# EAGLE design MCU_Module V3 (EAGLE 7.6.0)
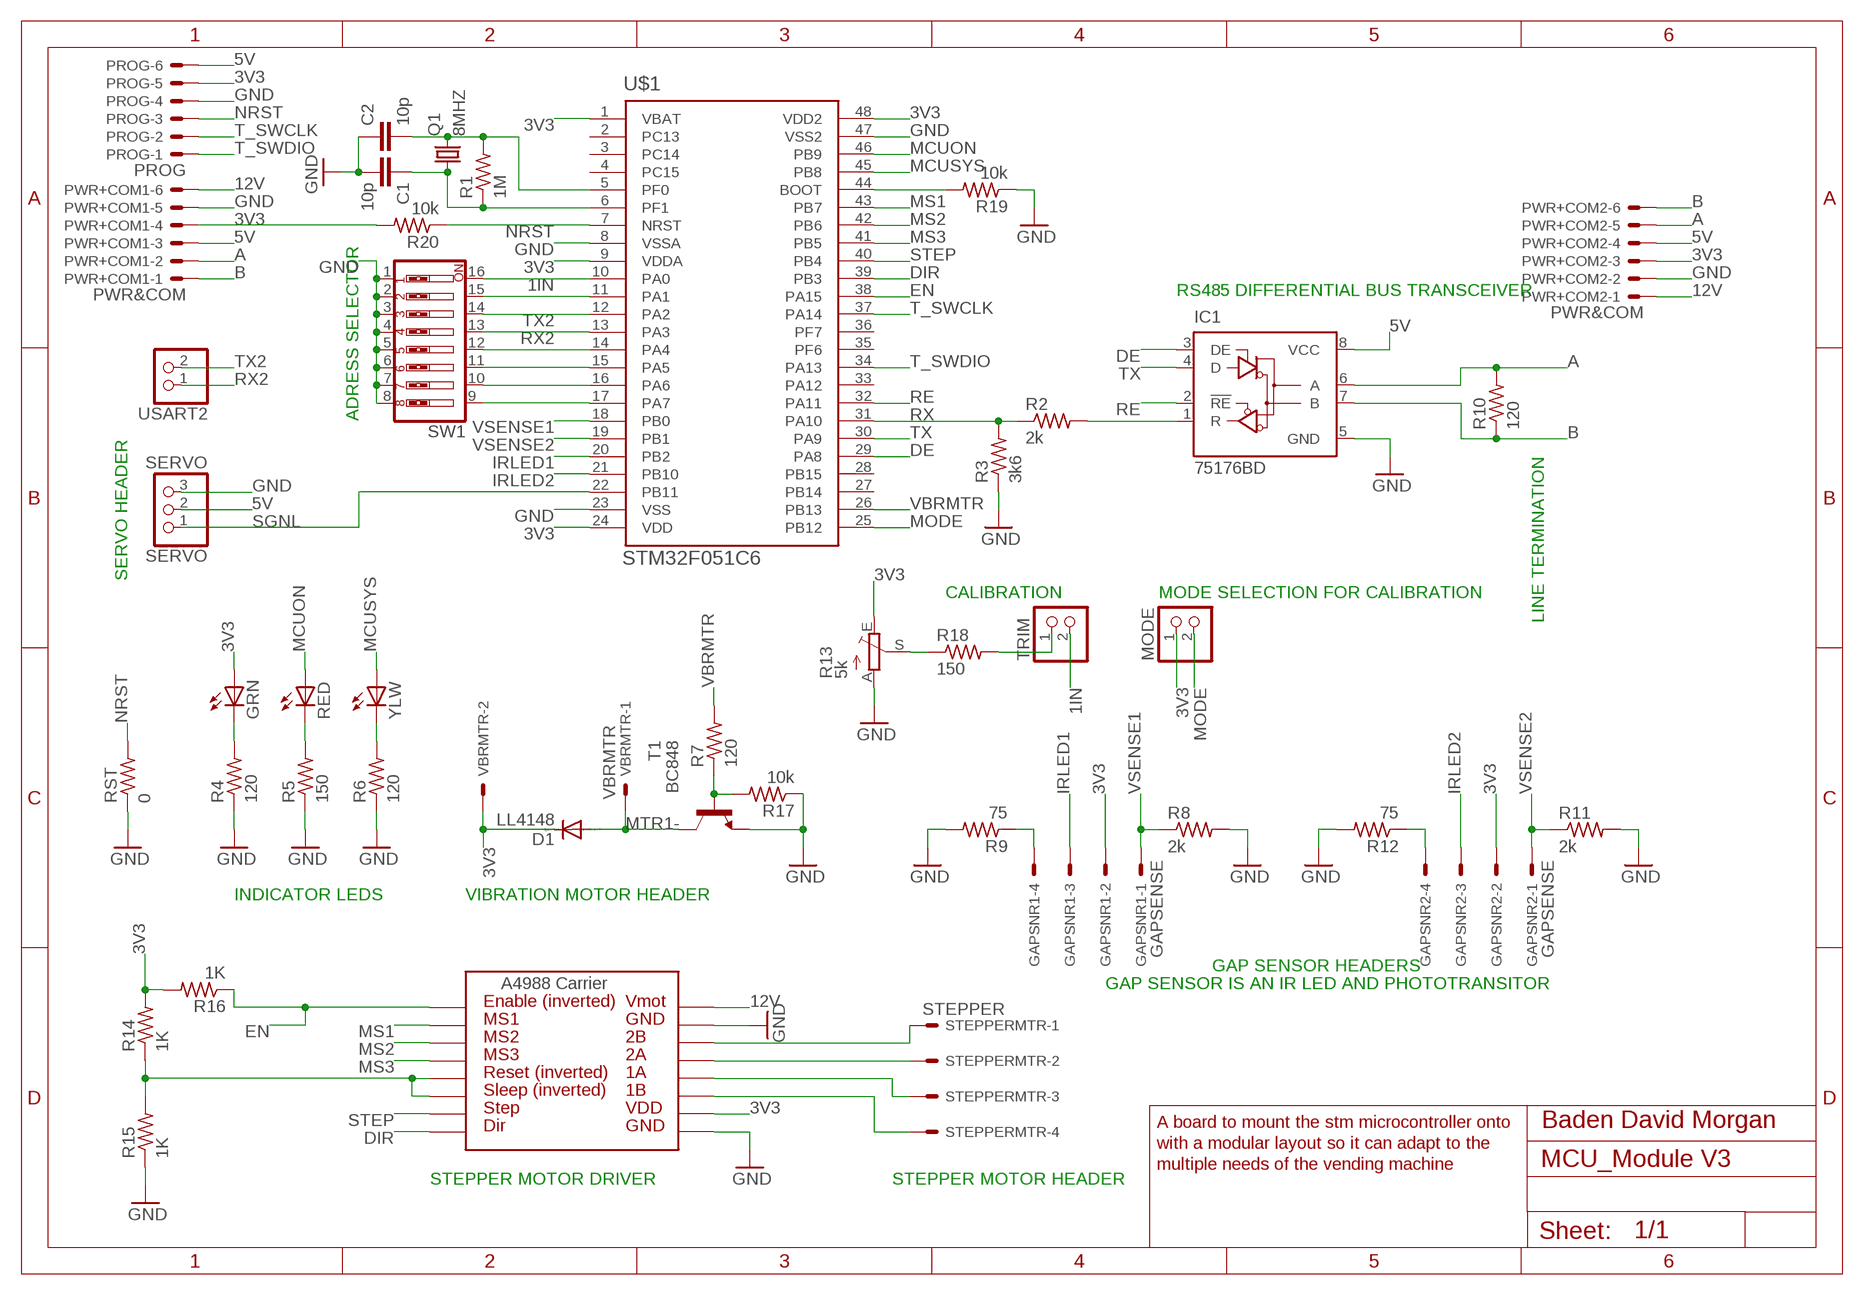
[diagram p0: schematic, sheet 1]

## Parts
C1  10p  C-EUC0805  [C0805]
C2  10p  C-EUC0805  [C0805]
D1  LL4148  PMLL4150  [SOD80C]
GAPSNR1  GAPSENSE  22-27-2041-04  [6410-04]
GAPSNR2  GAPSENSE  22-27-2041-04  [6410-04]
GRN  LEDSML1206  [SML1206]
IC1  75176BD  75176AD  [D_R-PDSO-G8]
MODE  PINHD-1X2  [1X02]
PROG  PROG  22-27-2061-06  [6410-06]
PWR+COM1  PWR&COM  22-05-7068-06  [7395-06]
PWR+COM2  PWR&COM  22-05-7068-06  [7395-06]
Q1  8MHZ  CRYSTALSM49  [SM49]
R1  1M  R-US_R0805  [R0805]
R2  2k  R-US_R0805  [R0805]
R3  3k6  R-US_R0805  [R0805]
R4  120  R-US_R0805  [R0805]
R5  150  R-US_R0805  [R0805]
R6  120  R-US_R0805  [R0805]
R7  120  R-US_R0805  [R0805]
R8  2k  R-US_R0805  [R0805]
R9  75  R-US_R0805  [R0805]
R10  120  R-US_R0805  [R0805]
R11  2k  R-US_R0805  [R0805]
R12  75  R-US_R0805  [R0805]
R13  5k  TRIM_EU-B25P  [B25P]
R14  1K  R-US_R0805  [R0805]
R15  1K  R-US_R0805  [R0805]
R16  1K  R-US_R0805  [R0805]
R17  10k  R-US_R0805  [R0805]
R18  150  R-US_R0805  [R0805]
R19  10k  R-US_R0805  [R0805]
R20  10k  R-US_R0805  [R0805]
RED  LEDSML1206  [SML1206]
RST  0  R-US_R0805  [R0805]
SERVO  SERVO  PINHD-1X3  [1X03]
STEPPERMTR  STEPPER  22-27-2041-04  [6410-04]
SW1  SW_DIP-8  [EDG-08]
T1  BC848  [SOT23]
TRIM  PINHD-1X2  [1X02]
U$1  STM32F051C6  [QFP50P900X900X160-48N]
U$2  A4983CARRIER  [A4988BREAKOUT]
USART2  PINHD-1X2  [1X02]
VBRMTR  VBRMTR  22-27-2021-02  [6410-02]
YLW  LEDSML1206  [SML1206]

## Nets
1IN: SW1.16 TRIM.2 U$1.10(PA0)
3V3: D1.C GAPSNR1.2 GAPSNR2.2 GRN.A MODE.1 PROG.5 PWR+COM1.4 PWR+COM2.3 R13.E R14.2 R16.2 R20.2 U$1.1(VBAT) U$1.9(VDDA) U$1.24(VDD) U$1.48(VDD2) U$2.VDD VBRMTR.2
5V: IC1.8(VCC) PROG.6 PWR+COM1.3 PWR+COM2.4 SERVO.2
8IN: SW1.9 U$1.17(PA7)
12V: PWR+COM1.6 PWR+COM2.1 U$2.VMOT
A: IC1.6(A) PWR+COM1.2 PWR+COM2.5 R10.2
B: IC1.7(B) PWR+COM1.1 PWR+COM2.6 R10.1
DE: IC1.3(DE) U$1.29(PA8)
DIR: U$1.39(PB3) U$2.DIR
EN: R16.1 U$1.38(PA15) U$2.EN
GND: C1.2 C2.1 IC1.5(GND) PROG.4 PWR+COM1.5 PWR+COM2.2 R3.1 R4.1 R5.1 R6.1 R8.2 R9.2 R11.2 R12.2 R13.A R15.1 R17.1 R19.1 RST.1 SERVO.3 SW1.1 SW1.2 SW1.3 SW1.4 SW1.5 SW1.6 SW1.7 SW1.8 T1.2(E) U$1.8(VSSA) U$1.23(VSS) U$1.47(VSS2) U$2.GND U$2.GND@0(GND)
IRLED1: GAPSNR1.3 U$1.20(PB2)
IRLED2: GAPSNR2.3 U$1.21(PB10)
MCUON: RED.A U$1.46(PB9)
MCUSYS: U$1.45(PB8) YLW.A
MODE: MODE.2 U$1.25(PB12)
MS1: U$1.43(PB7) U$2.MS1
MS2: U$1.42(PB6) U$2.MS2
MS3: U$1.41(PB5) U$2.MS3
MTR1-: D1.A T1.3(C) VBRMTR.1
N$1: C1.1 Q1.1 R1.1 U$1.6(PF1)
N$2: C2.2 Q1.2 R1.2 U$1.5(PF0)
N$5: STEPPERMTR.4 U$2.1B
N$6: SW1.15 U$1.11(PA1)
N$9: IC1.1(R) R2.2
N$10: SW1.12 U$1.14(PA4)
N$11: SW1.11 U$1.15(PA5)
N$12: SW1.10 U$1.16(PA6)
N$13: R13.S R18.1
N$14: GRN.C R4.2
N$15: R5.2 RED.C
N$16: R6.2 YLW.C
N$17: R7.1 R17.2 T1.1(B)
N$18: STEPPERMTR.3 U$2.1A
N$19: GAPSNR1.4 R9.1
N$20: STEPPERMTR.2 U$2.2A
N$21: STEPPERMTR.1 U$2.2B
N$22: R19.2 U$1.44(BOOT)
N$23: R18.2 TRIM.1
N$24: GAPSNR2.4 R12.1
N$26: R14.1 R15.2 U$2.RST U$2.SLP(SLEEP)
NRST: PROG.3 R20.1 RST.2 U$1.7(NRST)
RE: IC1.2(!RE) U$1.32(PA11)
RX: R2.1 R3.2 U$1.31(PA10)
RX2: SW1.13 U$1.13(PA3) USART2.1
SGNL: SERVO.1 U$1.22(PB11)
STEP: U$1.40(PB4) U$2.STEP
T_SWCLK: PROG.2 U$1.37(PA14)
T_SWDIO: PROG.1 U$1.34(PA13)
TX: IC1.4(D) U$1.30(PA9)
TX2: SW1.14 U$1.12(PA2) USART2.2
VBRMTR: R7.2 U$1.26(PB13)
VSENSE1: GAPSNR1.1 R8.1 U$1.18(PB0)
VSENSE2: GAPSNR2.1 R11.1 U$1.19(PB1)
Unconnected: U$1.2(PC13) U$1.3(PC14) U$1.4(PC15) U$1.27(PB14) U$1.28(PB15) U$1.33(PA12) U$1.35(PF6) U$1.36(PF7)

## Notes on the sheet
- RS485 DIFFERENTIAL BUS TRANSCEIVER
- ADRESS SELECTOR
- LINE TERMINATION
- SERVO HEADER
- CALIBRATION | MODE SELECTION FOR CALIBRATION
- INDICATOR LEDS | VIBRATION MOTOR HEADER
- GAP SENSOR HEADERS
- GAP SENSOR IS AN IR LED AND PHOTOTRANSITOR
- A board to mount the stm microcontroller onto | Baden David Morgan
- with a modular layout so it can adapt to the
- multiple needs of the vending machine
- STEPPER MOTOR DRIVER | STEPPER MOTOR HEADER

## Library data of the parts
C1 C2 = rcl:C-EU: CAPACITOR, European symbol
D1 = diode:PMLL4150: DIODE high speed
GAPSNR1 GAPSNR2 STEPPERMTR = con-molex:22-?-04: CONNECTOR wire to board 2.54 mm (.1 inch) pitch header; OC_FARNELL: unknown; OC_NEWARK: unknown
GRN RED YLW = led:LED: LED OSRAM: - CHIPLED LG R971, LG N971, LY N971, LG Q971, LY Q971, LO R971, LY R971 LH N974, LH R974 LS Q976, LO Q976, LY Q976 LO Q996 - Hyper CHIPLED LW Q18S LB Q993, LB Q99A, LB R99A - SideLED LS A670, LO A670, LY A670, LG A670, LP A670 LB A673, LV A673, LT A673, LW A673 LH A674 LY A675 LS A676, LA A676, LO A676, LY A676, LW A676 LS A679, LY A679, LG A679 - Hyper Micro SIDELED® LS Y876, LA Y876, LO Y876, LY Y876 LT Y87S - SmartLED LW L88C, LW L88S LB L89C, LB L89S, LG L890 LS L89K, LO L89K, LY L89K LS L896, LA L896, LO L896, LY L896 - TOPLED LS T670, LO T670, LY T670, LG T670, LP T670 LSG T670, LSP T670, LSY T670, LOP T670, LYG T670 LG T671, LOG T671, LSG T671 LB T673, LV T673, LT T673, LW T673 LH T674 LS T676, LA T676, LO T676, LY T676, LB T676, LH T676, LSB T676, LW T676 LB T67C, LV T67C, LT T67C, LS T67K, LO T67K, LY T67K, LW E67C LS E67B, LA E67B, LO E67B, LY E67B, LB E67C, LV E67C, LT E67C LW T67C LS T679, LY T679, LG T679 LS T770, LO T770, LY T770, LG T770, LP T770 LB T773, LV T773, LT T773, LW T773 LH T774 LS E675, LA E675, LY E675, LS T675 LS T776, LA T776, LO T776, LY T776, LB T776 LHGB T686 LT T68C, LB T68C - Hyper Mini TOPLED® LB M676 - Mini TOPLED Santana® LG M470 LS M47K, LO M47K, LY M47K Source: http://www.osram.convergy.de LUXEON: - LUMILED® LXK2-PW12-R00, LXK2-PW12-S00, LXK2-PW14-U00, LXK2-PW14-V00 LXK2-PM12-R00, LXK2-PM12-S00, LXK2-PM14-U00 LXK2-PE12-Q00, LXK2-PE12-R00, LXK2-PE12-S00, LXK2-PE14-T00, LXK2-PE14-U00 LXK2-PB12-K00, LXK2-PB12-L00, LXK2-PB12-M00, LXK2-PB14-N00, LXK2-PB14-P00, LXK2-PB14-Q00 LXK2-PR12-L00, LXK2-PR12-M00, LXK2-PR14-Q00, LXK2-PR14-R00 LXK2-PD12-Q00, LXK2-PD12-R00, LXK2-PD12-S00 LXK2-PH12-R00, LXK2-PH12-S00 LXK2-PL12-P00, LXK2-PL12-Q00, LXK2-PL12-R00 Source: www.luxeon.com KINGBRIGHT: KA-3528ASYC Source: www.kingbright.com
IC1 = 751xx:75176A: DIFFERENTIAL BUS TRANSCEIVER Source: http://focus.ti.com/lit/ds/symlink/sn75176a.pdf
MODE TRIM USART2 = pinhead:PINHD-1X2: PIN HEADER
PROG PWR+COM1 PWR+COM2 = con-molex:22-?-06: CONNECTOR wire to board 2.54 mm (.1 inch) pitch header; OC_FARNELL: unknown; OC_NEWARK: unknown
Q1 = crystal:CRYSTAL: CRYSTAL; OC_FARNELL: unknown; OC_NEWARK: unknown
R1 R4-R7 R9 R12 R14-R17 R19 R20 RST = rcl:R-US_: RESISTOR, American symbol
R2 R3 R8 R10 R11 R18 = resistor:R-US_: RESISTOR, American symbol
R13 = pot:TRIM_EU-: POTENTIOMETER
SERVO = pinhead:PINHD-1X3: PIN HEADER
SW1 = special:SW_DIP-8: DIP SWITCH
T1 = transistor:BC848: NPN TRANSISTOR
U$1 = STM32F0:STM32F051C6
U$2 = RepRapjr:A4983CARRIER
VBRMTR = con-molex:22-?-02: CONNECTOR wire to board 2.54 mm (.1 inch) pitch header; OC_FARNELL: unknown; OC_NEWARK: unknown

## Board
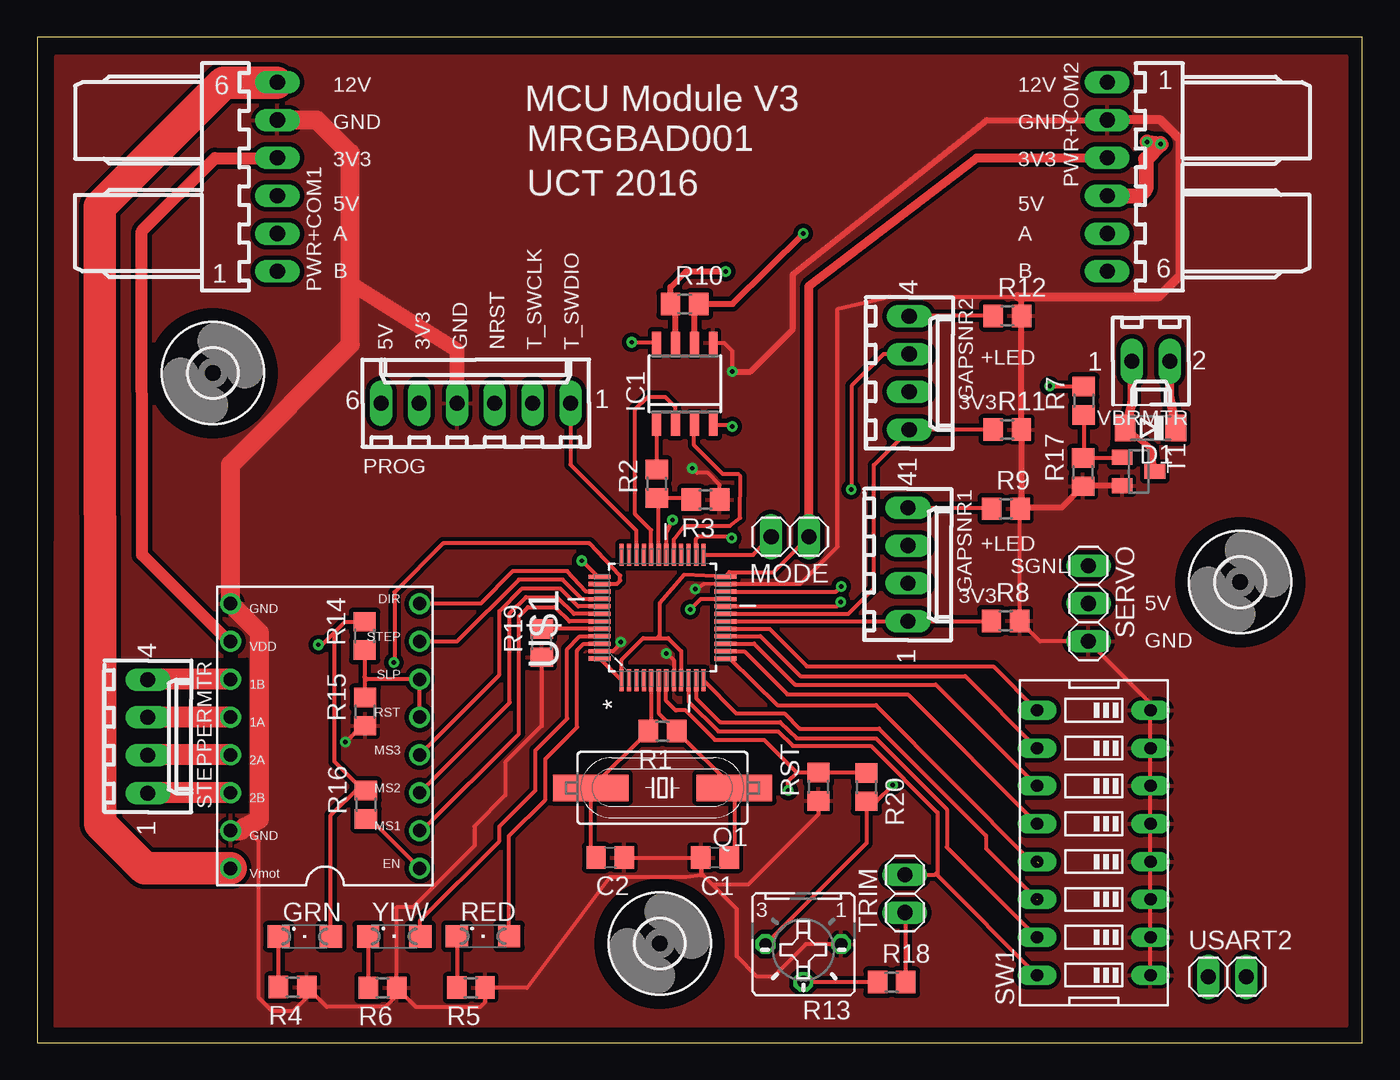
[diagram p1: board, top side]
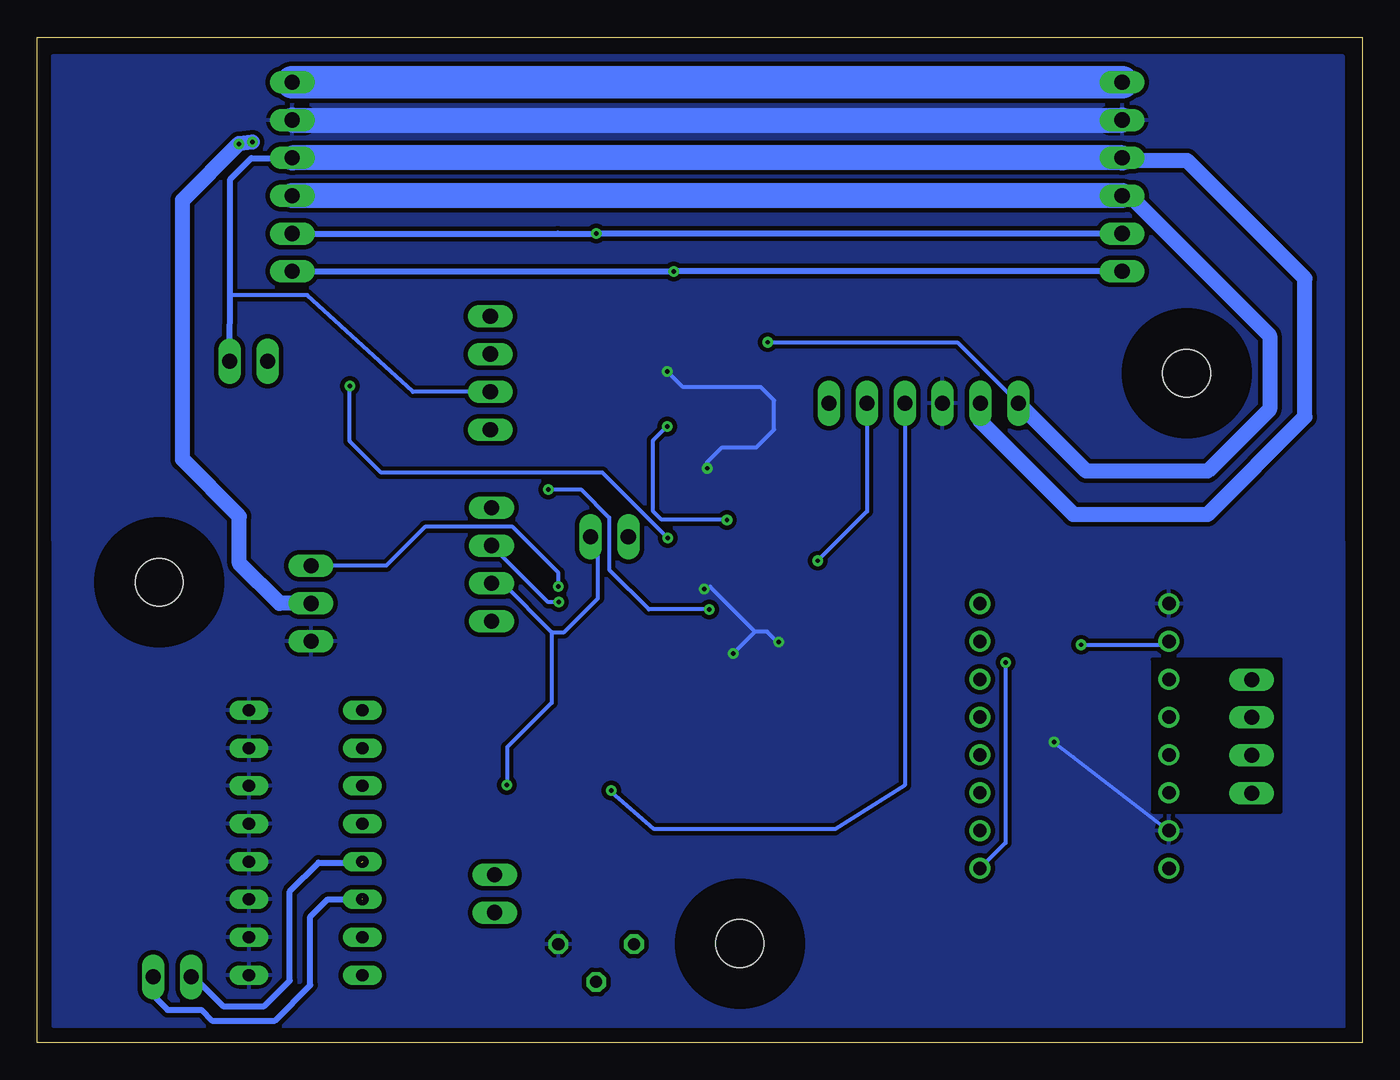
[diagram p2: board, bottom side, seen from below]

Size 89 x 67.5 mm. Coordinates in mm from the lower left corner, seen from the top.
Outline: 0,0 89,0 89,67.5 0,67.5 0,0
Copper layers (1*16): Top 0.035mm / dielectric 1.5mm / Bottom 0.035mm
Design rules "trax_discount_template": minimum track width 10mil, minimum drill 0.3mm, track to track 0.25mm, track to pad 0.25mm, pad to pad 0.25mm, via to via 0.25mm, smd to smd 0.25mm, copper to edge 0.5mm, drill to drill 0.35mm, minimum pad ring 10mil, minimum via ring 8mil, stop-mask expansion 4mil, vias tented up to drill 0mil, thermal gap 10mil

### Footprints (pad centres in the part's own frame; a part is rotated, then mirrored left to right if it is on the bottom)
C0805 = smd 1.3 x 1.5: 1 -0.95,0; 2 0.95,0
SOD80C = smd 1.4 x 1.8: A 1.7,0; C -1.7,0
6410-04 = drill 1.016 long: 1 3.81,0; 2 1.27,0; 3 -1.27,0; 4 -3.81,0
SML1206 = smd 1.5 x 1.5: A 1.75,0; C -1.75,0
D_R-PDSO-G8 = smd 0.6 x 1.5: 1 -1.905,-2.75; 2 -0.635,-2.75; 3 0.635,-2.75; 4 1.905,-2.75; 5 1.905,2.75; 6 0.635,2.75; 7 -0.635,2.75; 8 -1.905,2.75
1X02 = drill 1.016 long: 1 -1.27,0; 2 1.27,0
6410-06 = drill 1.016 long: 1 6.35,0; 2 3.81,0; 3 1.27,0; 4 -1.27,0; 5 -3.81,0; 6 -6.35,0
7395-06 = drill 1.016 long: 1 6.35,0; 2 3.81,0; 3 1.27,0; 4 -1.27,0; 5 -3.81,0; 6 -6.35,0
SM49 = smd 5.08 x 1.778: 1 -4.826,0; 2 4.826,0
R0805 = smd 1.3 x 1.5: 1 -0.95,0; 2 0.95,0
B25P = drill 0.813 octagon: A -2.54,0; E 2.54,0; S 0,2.54
1X03 = drill 1.016 long: 1 -2.54,0; 2 0,0; 3 2.54,0
EDG-08 = drill 0.813 long: 1 -8.89,-3.81; 2 -6.35,-3.81; 3 -3.81,-3.81; 4 -1.27,-3.81; 5 1.27,-3.81; 6 3.81,-3.81; 7 6.35,-3.81; 8 8.89,-3.81; 9 8.89,3.81; 10 6.35,3.81; 11 3.81,3.81; 12 1.27,3.81; 13 -1.27,3.81; 14 -3.81,3.81; 15 -6.35,3.81; 16 -8.89,3.81
SOT23 = smd 1 x 1.4: 1 -0.95,-1.1; 2 0.95,-1.1; 3 0,1.1
QFP50P900X900X160-48N = smd 1.473 x 0.279: 1 -4.216,2.743; 2 -4.216,2.261; 3 -4.216,1.753; 4 -4.216,1.245; 5 -4.216,0.762; 6 -4.216,0.254; 7 -4.216,-0.254; 8 -4.216,-0.762; 9 -4.216,-1.245; 10 -4.216,-1.753; 11 -4.216,-2.261; 12 -4.216,-2.743; 25 4.216,-2.743; 26 4.216,-2.261; 27 4.216,-1.753; 28 4.216,-1.245; 29 4.216,-0.762; 30 4.216,-0.254; 31 4.216,0.254; 32 4.216,0.762; 33 4.216,1.245; 34 4.216,1.753; 35 4.216,2.261; 36 4.216,2.743 | smd 0.279 x 1.473: 13 -2.743,-4.216; 14 -2.261,-4.216; 15 -1.753,-4.216; 16 -1.245,-4.216; 17 -0.762,-4.216; 18 -0.254,-4.216; 19 0.254,-4.216; 20 0.762,-4.216; 21 1.245,-4.216; 22 1.753,-4.216; 23 2.261,-4.216; 24 2.743,-4.216; 37 2.743,4.216; 38 2.261,4.216; 39 1.753,4.216; 40 1.245,4.216; 41 0.762,4.216; 42 0.254,4.216; 43 -0.254,4.216; 44 -0.762,4.216; 45 -1.245,4.216; 46 -1.753,4.216; 47 -2.261,4.216; 48 -2.743,4.216
A4988BREAKOUT = drill 0.9: 1A 8.89,1.27; 1B 11.43,1.27; 2A 6.35,1.27; 2B 3.81,1.27; DIR 16.51,-11.43; EN -1.27,-11.43; GND 16.51,1.27; GND@0 1.27,1.27; MS1 1.27,-11.43; MS2 3.81,-11.43; MS3 6.35,-11.43; RST 8.89,-11.43; SLP 11.43,-11.43; STEP 13.97,-11.43; VDD 13.97,1.27; VMOT -1.27,1.27
3,2 = hole 3.2: 0,0
6410-02 = drill 1.016 long: 1 1.27,0; 2 -1.27,0

### Placement (x,y rotation side)
C1  45.52,12.42 180 top
C2  38.48,12.42 180 top
D1  74.77,41.26 180 top
GAPSNR1  58.48,32.1 270 top
GAPSNR2  58.57,44.96 270 top
GRN  17.97,7.12 0 top
IC1  43.5,44.23 0 top
MODE  50.57,33.96 180 top
PROG  29.46,42.93 0 top
PWR+COM1  16.13,58.13 270 top
PWR+COM2  71.87,58.13 90 top
Q1  42,17.1 180 top
R1  42,20.91 180 top
R2  41.61,37.52 90 top
R3  44.89,36.46 180 top
R4  17.16,3.72 180 top
R5  29.13,3.69 180 top
R6  23.2,3.68 180 top
R7  70.29,43.09 90 top
R8  65.04,28.31 0 top
R9  65.06,35.84 0 top
R10  43.49,49.59 0 top
R11  65.15,41.16 0 top
R12  65.16,48.79 0 top
R13  51.46,6.61 180 top
R14  21.99,27.3 90 top
R15  22.02,22.22 90 top
R16  22.08,15.97 90 top
R17  70.24,38.3 90 top
R18  57.39,4.06 0 top
R19  33.88,26.82 90 top
R20  55.7,17.15 270 top
RED  29.94,7.14 0 top
RST  52.47,17.17 90 top
SERVO  70.61,29.48 270 top
STEPPERMTR  7.43,20.56 270 top
SW1  70.97,13.42 90 top
T1  73.97,38.34 270 top
TRIM  58.27,10 90 top
U$1  42,28.53 90 top
U$2  14.25,12.96 90 top
U$3  [3,2]  80.8,30.91 0 top
U$4  [3,2]  41.81,6.65 0 top
U$5  [3,2]  11.8,44.95 0 top
USART2  79.94,4.41 0 top
VBRMTR  74.8,45.75 180 top
YLW  23.98,7.13 0 top

### Tracks (layer width: path | path; a pad name or v marks a point on that pad's centre or on a via)
1IN
  Top 0.254: U$1.10 43.75,22.9 45.75,20.9 49.77,20.9 50.75,19.92 55.99,19.92 60.47,15.44 60.47,11.43 | 60.47,11.43 60.47,11.22 SW1.16 | TRIM.2 60.31,11.27 60.47,11.43
3V3  (via drill 0.3)
  Top 0.254: U$1.48 U$1.1 39.26,25.72 40.7,27.16 41.63,27.16 | 41.63,27.16 42.37,27.16 43.25,26.28 U$1.9 | 41.63,27.16 41.81,27.34 41.81,29.5 43.43,31.4 U$1.24 46.22,31.31 46.49,31.58 49.46,31.58 MODE.1 | R13.E 55.7,13.39 R20.2 56.38,16.2 v57.46,17.28 | R16.2 21.91,16.92 21.64,17.19 | 21.64,17.19 19.97,18.86 19.97,27.55 | 19.97,27.55 20.67,28.25 R14.2 | GRN.A 19.72,15.27 21.64,17.19 | v18.9,26.71 19.13,26.71 19.97,27.55
  Top 0.406: U$2.VDD 12.85,26.93 | 16.11,59.38 PWR+COM1.4
  Top 0.61: VBRMTR.2 76.05,43.41 D1.C | MODE.1 51.84,50.8 63.11,59.4 PWR+COM2.3
  Top 0.813: 12.85,26.93 7.04,32.74 7.03,54.49 11.92,59.38 16.11,59.38
  Bottom 0.254: v18.9,26.71 13.2,26.71 U$2.VDD | PWR+COM2.3 | GAPSNR1.2 57.72,30.83 54.45,27.56 | 54.45,27.56 53.6,27.56 51.34,29.82 51.34,33.46 MODE.1 | GAPSNR2.2 63.76,43.69 70.87,50.18 76.04,50.18 76.05,50.75 | 54.45,27.56 54.45,22.81 57.43,19.83 57.43,17.31 v57.46,17.28
  Bottom 0.406: VBRMTR.2 76.05,50.75 76.04,57.97 74.62,59.39 PWR+COM2.3
  Bottom 1.016: PROG.5 25.65,41.71 19.41,35.47 10.39,35.47 3.85,42.01 3.85,51.31 11.76,59.22 15.95,59.22 PWR+COM1.4
  Bottom 1.676: PWR+COM1.4 PWR+COM2.3
5V  (via drill 0.3)
  Top 0.254: IC1.8 39.97,46.98 v39.93,47.02
  Top 1.016: v74.55,60.45 v75.45,60.35 75.49,60.31 75.45,60.31 74.46,59.32 74.46,57.3 73.99,56.83 71.9,56.83 PWR+COM2.4
  Bottom 0.254: v39.93,47.02 27.2,47.02 PROG.6
  Bottom 1.016: SERVO.2 72.72,29.48 75.42,32.18 75.42,35.33 79.24,39.15 79.23,56.57 v75.46,60.34 v75.45,60.35 v74.55,60.45 | PWR+COM1.3 15.62,56.86 6.22,47.46 6.22,42.52 10.38,38.36 18.54,38.36 PROG.6
  Bottom 1.676: PWR+COM1.3 PWR+COM2.4
8IN
  Top 0.254: U$1.17 49.19,27.77 51.7,25.26 64.21,25.26 SW1.9
12V
  Top 1.27: 16.08,64.43 PWR+COM1.6
  Top 2.184: U$2.VMOT 7.22,11.69 4.22,14.69 4.21,56.13 12.51,64.43 16.08,64.43
  Bottom 2.184: PWR+COM1.6 PWR+COM2.1
A  (via drill 0.3)
  Top 0.406: v51.46,54.32 46.71,49.59 R10.2 44.13,49.28 IC1.6
  Bottom 0.406: PWR+COM2.5 54.05,54.32 v51.46,54.32 PWR+COM1.2
B  (via drill 0.3)
  Top 0.406: v46.26,51.78 43.57,51.78 42.53,50.73 R10.1 42.87,49.27 IC1.7
  Bottom 0.406: PWR+COM2.6 v46.26,51.78 | PWR+COM1.1 v46.26,51.78 | 48.05,51.78 v46.26,51.78
DE
  Top 0.254: U$1.29 42.76,33.76 43.48,34.69 46.51,34.69 47.21,35.23 47.22,38.01 47.07,38.16 46.06,38.16 44.13,40.09 IC1.3
DIR
  Top 0.254: U$1.39 36.85,30.28 35.6,31.65 31.93,31.65 29.79,29.47 U$2.DIR
EN  (via drill 0.3)
  Top 0.254: U$1.38 38.93,30.79 39.15,31.01 39.16,31.35 37.09,33.52 27.27,33.52 24,30.25 24,25.55 v23.96,25.51 | R16.1 22.35,15.02 U$2.EN
  Bottom 0.254: v23.96,25.51 23.96,13.41 U$2.EN
GND  (via drill 0.3)
  Top 0.254: v42.26,26.12 42.31,26.12 42.77,25.66 42.77,24.32 U$1.8 | v44.21,30.45 44.74,30.77 U$1.23 51.25,30.79 53.75,33.29 53.75,49.26 57.25,50.09 65.84,50.09 66.09,49.84 | v39.2,26.91 39.2,26.8 38.67,26.27 U$1.47 | R3.1 45.84,37.45 45.04,38.25 44.32,38.25 v44.01,38.56 | IC1.5 46.13,46.98 46.67,46.44 v46.67,45.05 | C2.1 C1.2 | RST.1 52.47,15.32 47.75,10.6 45.35,10.6 | 45.35,10.6 44.64,11.31 44.64,12.35 C1.2 | R6.1 25.45,2.38 29.75,2.38 30.08,2.71 R5.1 30.1,3.67 32.9,3.67 38.45,11.11 43.6,11.1 44.57,11.23 C1.2 | R6.1 24.15,3.14 23.4,2.39 19.44,2.39 18.46,3.37 | 18.46,3.37 R4.1 | SW1.1 SW1.2 SW1.3 SW1.4 SW1.5 SW1.6 SW1.7 SW1.8 74.78,22.77 SERVO.3 67.36,26.94 R8.2 65.99,35.82 R9.2 66.1,35.93 | R12.2 | 70.28,37.39 R17.1 | R13.A 51.62,6.61 49.44,4.43 48.35,4.43 46.99,5.79 46.99,8.96 45.35,10.6 | 18.46,3.37 17.2,2.11 15.78,2.11 14.88,3.01 14.88,13.51 13.92,14.47 | PWR+COM2.2 | R15.1 21.8,21.27 v20.71,20.18 | R19.1 33.88,21.26 31.43,18.81 31.43,16.59 29.36,14.52 29.36,13.2 25.23,9.07 24.15,9.07 24.1,9.02 24.1,3.73 R6.1
  Top 0.406: T1.2 70.28,37.39 | R17.1 68.82,35.93 66.1,35.93 R11.2 R12.2 66.09,49.84 | v46.67,45.05 47.9,45.05 50.75,47.9 50.75,51.58 63.78,61.94 PWR+COM2.2
  Top 0.61: 65.84,50.09 75.34,50.09 76.77,51.52 76.77,60.63 75.45,61.95 PWR+COM2.2
  Top 1.016: PROG.4 28.19,46.49 21.02,50.97
  Top 1.27: U$2.GND@0 13.68,14.23 13.92,14.47 14.93,14.98 14.93,27.52 U$2.GND 12.98,38.81 21.03,46.86 21.02,50.97 21.02,59.72 18.8,61.94 PWR+COM1.5
  Bottom 0.254: v39.2,26.91 39.3,26.91 39.98,27.59 40.79,27.59 | 40.79,27.59 v42.26,26.12 | v44.21,30.45 43.81,30.61 40.79,27.59 | v44.01,38.56 44.01,38.95 42.99,39.97 40.69,39.97 39.51,41.15 39.51,43.12 40.39,44 45.62,44 v46.67,45.05 | v20.71,20.18 19.43,19.18 U$2.GND@0
  Bottom 1.676: PWR+COM2.2 PWR+COM1.5
  pour Bottom (isolate 0.3): 1.28,66.22 87.96,66.22 87.91,1.12 1.23,1.12
  pour Top (isolate 0.3): 1.28,66.23 87.92,66.24 87.91,1.12 1.23,1.12
IRLED1  (via drill 0.3)
  Top 0.254: U$1.20 53.68,29.29 v53.96,29.57
  Bottom 0.254: v53.96,29.57 54.68,29.57 GAPSNR1.3
IRLED2  (via drill 0.3)
  Top 0.254: GAPSNR2.3 56.84,46.23 54.7,44.09 54.7,37.16 v54.68,37.14 | U$1.21 44.56,29.77 v43.87,29.08
  Bottom 0.254: v54.68,37.14 52.48,37.14 50.58,35.24 50.58,31.75 47.91,29.08 v43.87,29.08
MCUON
  Top 0.254: RED.A 31.69,13.87 34.13,16.31 34.13,19.04 36.27,21.18 36.27,26.33 36.71,26.77 U$1.46
MCUSYS
  Top 0.254: YLW.A 25.73,8.21 31.04,13.52 31.04,14.52 33.46,16.94 33.46,19.62 35.59,21.75 35.59,26.42 36.44,27.27 37.77,27.27 U$1.45
MODE
  Top 0.254: U$1.25 48.09,32.75 MODE.2
MS1
  Top 0.254: U$2.MS1 25.83,14.23 32.35,20.75 32.35,28.63 32.96,29.24 34.78,29.24 35.74,28.28 U$1.43
MS2
  Top 0.254: U$2.MS2 31.73,22.82 31.73,28.81 32.82,29.9 34.93,29.9 36.05,28.78 U$1.42
MS3
  Top 0.254: U$2.MS3 25.68,19.33 31.05,24.7 31.05,28.97 32.58,30.5 35.12,30.5 36.33,29.29 U$1.41
MTR1-
  Top 0.406: T1.3 74.84,39.87 D1.A
  Top 0.61: VBRMTR.1 73.51,42.97 D1.A
N$1
  Top 0.254: U$1.6 41.75,22.11 R1.1 46.76,17.1 Q1.1 46.83,12.78 C1.1
N$2
  Top 0.254: U$1.5 41.24,21.1 R1.2 37.24,17.1 Q1.2 37.17,12.78 C2.2
N$3
  cutout Top (isolate 0.15): 5.48,25.71 14.08,25.71 14.08,15.51 5.48,15.51
N$5
  Top 1.422: U$2.1B 7.45,24.39 STEPPERMTR.4
N$6
  Top 0.254: SW1.15 61.1,13.13 61.1,15.68 56.35,20.43 51.02,20.43 49.89,21.51 45.87,21.51 44.26,23.12 U$1.11
N$9
  Top 0.254: IC1.1 41.59,38.48 R2.2
N$10
  Top 0.254: U$1.14 47.5,26.27 50.39,23.38 58.47,23.38 SW1.12
N$11
  Top 0.254: U$1.15 48.15,26.78 50.9,24.03 60.36,24.03 SW1.11
N$12
  Top 0.254: U$1.16 48.58,27.29 51.26,24.6 62.33,24.6 SW1.10
N$13
  Top 0.254: R18.1 R13.S
N$14
  Top 0.254: R4.2 GRN.C
N$15
  Top 0.254: RED.C R5.2
N$16
  Top 0.254: YLW.C 22.23,3.7 R6.2
N$17
  Top 0.254: T1.1 72.83,39.25 R17.2 70.29,39.3 R7.1
N$18
  Top 1.422: U$2.1A 7.45,21.85 STEPPERMTR.3
N$19
  Top 0.254: GAPSNR1.4 64.04,35.91 R9.1
N$20
  Top 1.422: U$2.2A 7.45,19.31 STEPPERMTR.2
N$21
  Top 1.422: U$2.2B 7.45,16.77 STEPPERMTR.1
N$22
  Top 0.254: U$1.44 R19.2
N$23
  Top 0.254: R18.2 58.34,8.66 TRIM.1
N$24
  Top 0.254: R12.1 58.59,48.79 GAPSNR2.4
N$26
  Top 0.254: U$2.RST U$2.SLP 22.15,24.39 21.99,24.55 | R14.1 21.99,24.55 | 21.99,24.55 21.99,23.2 R15.2
N$28
  cutout Bottom (isolate 0.15): 5.48,25.71 14.08,25.71 14.08,15.51 5.48,15.51
NRST  (via drill 0.3)
  Top 0.254: R20.1 52.49,18.1 RST.2 51.02,18.12 | 51.02,18.12 48.81,20.33 45.52,20.33 43.55,22.3 42.91,22.3 42.9,22.29 42.25,22.94 U$1.7 | v50.44,16.93 50.44,17.54 51.02,18.12
  Bottom 0.254: PROG.3 30.73,17.29 35.42,14.33 47.56,14.33 50.43,16.79 v50.43,16.92 v50.44,16.93
RE
  Top 0.254: U$1.32 41.24,34.4 40.16,35.48 40.16,42.51 41.01,43.36 42.18,43.36 42.85,42.69 42.85,41.49 IC1.2
RX
  Top 0.254: R3.2 43.83,36.57 R2.1 41.75,36.43 U$1.31
RX2  (1 unrouted)
  Top 0.254: SW1.13 66.79,12.15 56.35,22.65 49.71,22.65 46.51,25.79 U$1.13
  Bottom 0.406: USART2.1 78.48,4.41 76.52,2.45 73.75,2.45 72.04,4.16 72.04,10.15 70.11,12.08 67.23,12.08
SGNL  (via drill 0.3)
  Top 0.254: U$1.22 53.64,30.28 v53.99,30.63
  Bottom 0.254: v53.99,30.63 53.99,31.54 57.07,34.62 62.95,34.62 65.55,32.02 SERVO.1
STEP
  Top 0.254: U$1.40 36.59,29.77 35.29,31.08 32.35,31.08 28.2,26.93 U$2.STEP
T_SWCLK  (via drill 0.3)
  Top 0.254: U$1.37 37.67,31.27 v36.59,32.35
  Bottom 0.254: PROG.2 33.27,35.67 v36.59,32.35
T_SWDIO
  Top 0.254: PROG.1 35.81,38.8 40.25,34.36 U$1.34
TX  (via drill 0.3)
  Top 0.254: U$1.30 42.25,34.23 v42.67,35.09 | IC1.4 46.58,41.48 v46.69,41.37
  Bottom 0.254: v42.67,35.09 47.06,35.11 47.63,35.66 47.63,40.43 v46.69,41.37
TX2  (1 unrouted)
  Top 0.254: U$1.12 46.95,22.11 50.18,22.11 51.21,21.08 56.54,21.08 63.73,13.89 63.73,13.04 SW1.14
  Bottom 0.406: USART2.2 81.21,3.16 80.24,2.19 77.97,2.19 77.26,1.48 73.03,1.48 70.66,3.85 70.66,8.45 69.49,9.62 SW1.14
VBRMTR  (via drill 0.3)
  Top 0.254: R7.2 68.04,44.04 v68.01,44.07 | U$1.26 44.26,33.84 44.42,34 46.52,34 v46.65,33.87
  Bottom 0.254: v46.65,33.87 v46.65,33.88 51.03,38.26 65.89,38.26 68.01,40.38 v68.01,44.07
VSENSE1
  Top 0.254: R8.1 64.07,28.29 GAPSNR1.1 58.47,28.28 U$1.18
VSENSE2
  Top 0.254: R11.1 GAPSNR2.1 56.19,38.77 56.19,30.5 54.47,28.78 U$1.19

### Text on the board
tNames: 12V | 12V | MCU Module V3 | GND | GND | MRGBAD001 | 3V3 | 3V3 | UCT 2016 | 5V | 5V | A | A | B | B | 5V | 3V3 | GND | NRST | T_SWCLK | T_SWDIO | +LED | 3V3 | +LED | SGNL | 3V3 | 5V | GND